# EAGLE design sheet1 (EAGLE 9.6.2)
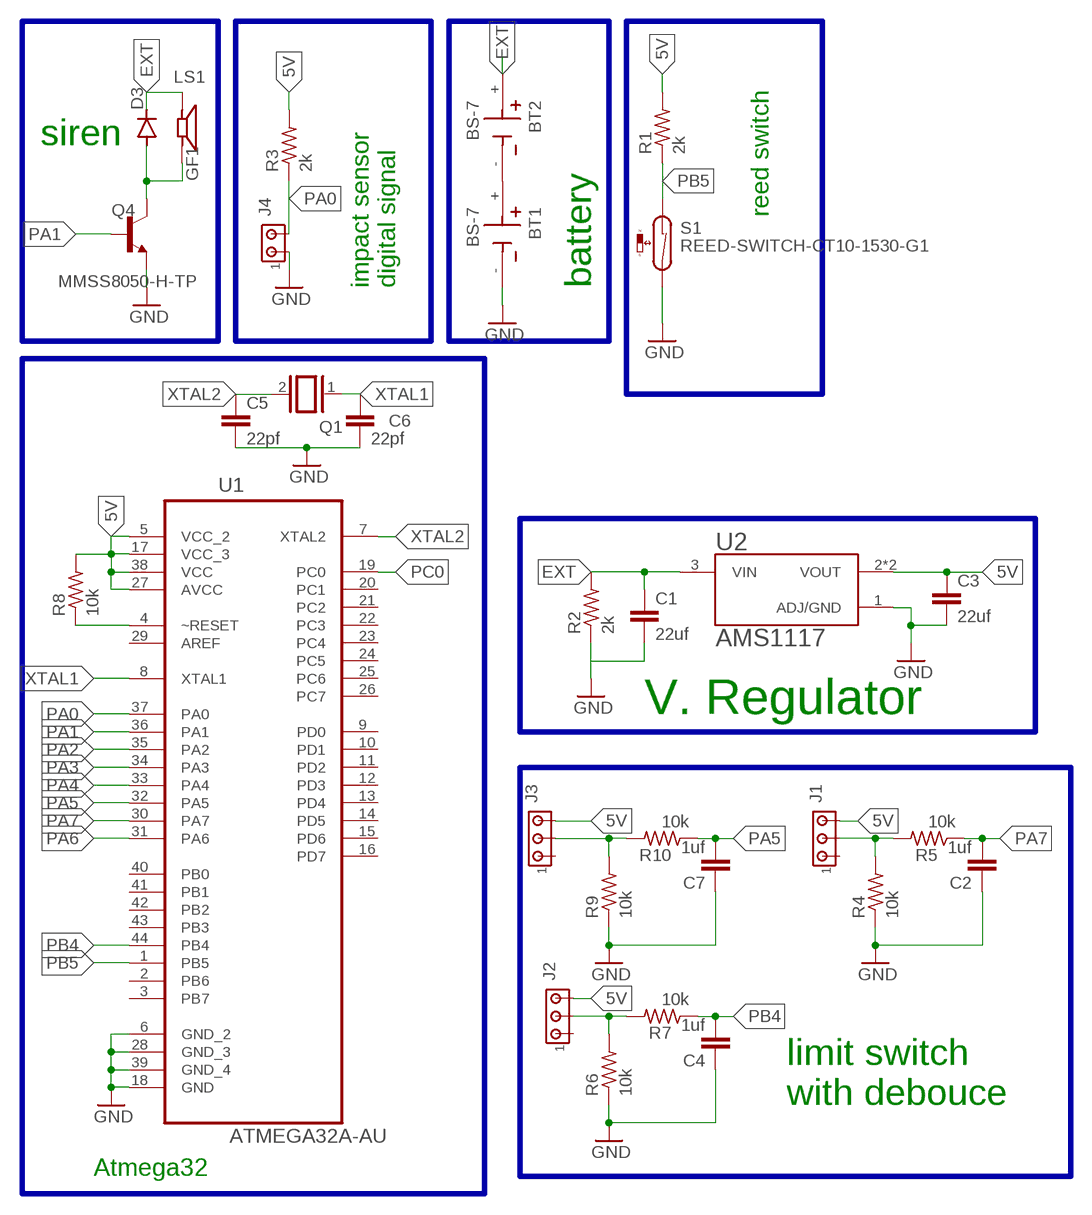
[diagram p0: schematic, sheet 1]

## Parts
BT1  BS-7  [BAT_BS-7]
BT2  BS-7  [BAT_BS-7]
C1  22uf  C-EUC1206  [C1206]
C2  1uf  C-EUC1206  [C1206]
C3  22uf  C-EUC1206  [C1206]
C4  1uf  C-EUC1206  [C1206]
C5  22pf  C-EUC1206  [C1206]
C6  22pf  C-EUC1206  [C1206]
C7  1uf  C-EUC1206  [C1206]
D3  GF1  [SMA-DO214AC]
J1  MTA03-100  [10X03MTA]
J2  MTA03-100  [10X03MTA]
J3  MTA03-100  [10X03MTA]
J4  MTA02-100  [10X02MTA]
LS1  CEP-1152  [CUI_CEP-1152]
Q1  XTAL/S  [QS]
Q4  MMSS8050-H-TP  [TRANS_MMSS8050-H-TP]
R1  2k  R-US_R1206  [R1206]
R2  2k  R-US_R1206  [R1206]
R3  2k  R-US_R1206  [R1206]
R4  10k  R-US_R1206  [R1206]
R5  10k  R-US_R1206  [R1206]
R6  10k  R-US_R1206  [R1206]
R7  10k  R-US_R1206  [R1206]
R8  10k  R-US_R1206  [R1206]
R9  10k  R-US_R1206  [R1206]
R10  10k  R-US_R1206  [R1206]
S1  REED-SWITCH-CT10-1530-G1  [CT10-G1]
U1  ATMEGA32A-AU  [QFP80P1200X1200X120-44N]
U2  AMS1117  [SOT229P700X180-4N]

## Nets
5V: C3.1 J1.3 J2.3 J3.3 R1.2 R3.2 R8.2 U1.5(VCC_2) U1.17(VCC_3) U1.27(AVCC) U1.38(VCC) U2.2(VOUT) U2.4(VOUT)
EXT: BT2.+ C1.1 D3.K(C) LS1.1 R2.2 U2.3(VIN)
GND: BT1.- C1.2 C2.1 C3.2 C4.1 C5.2 C6.2 C7.1 J4.1 Q4.2(E) R2.1 R4.1 R6.1 R9.1 S1.2 U1.6(GND_2) U1.18(GND) U1.28(GND_3) U1.39(GND_4) U2.1(ADJ/GND)
N$1: J1.2 R4.2 R5.2
N$3: BT1.+ BT2.-
N$4: R8.1 U1.4(~RESET)
N$6: J3.2 R9.2 R10.2
N$10: J2.2 R6.2 R7.2
N$27: D3.A LS1.2 Q4.3(C)
PA0: J4.2 R3.1 U1.37(PA0)
PA1: Q4.1(B) U1.36(PA1)
PA2: U1.35(PA2)
PA3: U1.34(PA3)
PA4: U1.33(PA4)
PA5: C7.2 R10.1 U1.32(PA5)
PA6: U1.31(PA6)
PA7: C2.2 R5.1 U1.30(PA7)
PB4: C4.2 R7.1 U1.44(PB4)
PB5: R1.1 S1.1 U1.1(PB5)
PC0: U1.19(PC0)
XTAL1: C6.1 Q1.1 U1.8(XTAL1)
XTAL2: C5.1 Q1.2 U1.7(XTAL2)
Unconnected: J1.1 J2.1 J3.1 U1.2(PB6) U1.3(PB7) U1.9(PD0) U1.10(PD1) U1.11(PD2) U1.12(PD3) U1.13(PD4) U1.14(PD5) U1.15(PD6) U1.16(PD7) U1.20(PC1) U1.21(PC2) U1.22(PC3) U1.23(PC4) U1.24(PC5) U1.25(PC6) U1.26(PC7) U1.29(AREF) U1.40(PB0) U1.41(PB1) U1.42(PB2) U1.43(PB3)

## Buses
B$1
B$2
5V,PA1,GND
B$3
B$4
B$5
B$6

## Notes on the sheet
- siren
- reed switch
- impact sensor 
  digital signal
- battery
- V. Regulator
- limit switch 
  with debouce
- Atmega32

## Library data of the parts
BT1 BT2 = BS-7:BS-7: BATTERY HOLDER COIN 20MM PC PIN; AVAILABILITY: Unavailable; DESCRIPTION: BATTERY HOLDER COIN 20MM PC PIN; MF: MPD _Memory; MP: BS-7; PACKAGE: None; PRICE: None
C1-C7 = rcl:C-EU: CAPACITOR, European symbol; SPICEPREFIX: C
D3 = diode:GF1: DIODE
J1-J3 = con-amp:MTA03-100: AMP connector
J4 = con-amp:MTA02-100: AMP connector
LS1 = CEP-1152:CEP-1152: 16.5 mm, 30 V, 84 dB, Through Hole, Piezo Audio Transducer Buzzer; AVAILABILITY: Unavailable; CUI_PURCHASE_URL: https://www.cuidevices.com/product/audio/buzzers/audio-transducers/cep-1152?utm_source=snapeda.com&utm_medium=referral&utm_campaign=snapedaBOM; DESCRIPTION: 16.5 mm, 30 V, 84 dB, Through Hole, Piezo Audio Transducer Buzzer; DIGIKEY-PURCHASE-URL: https://snapeda.com/shop?store=DigiKey&id=2769834; MF: CUI Devices; MP: CEP-1152; PACKAGE: CUI; PRICE: None
Q1 = special:XTAL/S: CRYSTAL
Q4 = MMSS8050-H-TP:MMSS8050-H-TP: MMSS8050-H Series 25 V 1.5 A NPN Silicon Plastic-Encapsulate Transistor-SOT-23; AVAILABILITY: Unavailable; DESCRIPTION: Bipolar _BJT_ Transistor NPN 25V 1.5A 100MHz 625mW Surface Mount SOT-23; MF: Micro Commercial; MP: MMSS8050-H-TP; PACKAGE: SOT-23 Micro Commercial; PRICE: None
R1-R10 = rcl:R-US_: RESISTOR, American symbol; SPICEPREFIX: R
S1 = switch-reed:REED-SWITCH-: Reed Sensor; MF: COTO TECHNOLOGY; MPN: CT10-1530-G1; OC_FARNELL: 1081696
U1 = ATMEGA32A-AU:ATMEGA32A-AU: 8-bit Microcontroller; AVAILABILITY: Unavailable; DESCRIPTION: AVR AVR® ATmega Microcontroller IC 8-Bit 16MHz 32KB (16K x 16) FLASH 44-TQFP (10x10); MF: Microchip; MP: ATMEGA32A-AU; PACKAGE: TQFP-44 Microchip; PRICE: None
U2 = AMS1117:AMS1117: Sot223/Pkg 1-Amp 5-Volt Low Drop Out Voltage Regulatator; AVAILABILITY: Unavailable; DESCRIPTION: UNO PLUS Arduino R3 Shield, Xbee Arduino IDE Wheeled Robotics Kit; MF: Seeed Technology; MP: AMS1117; PACKAGE: SOT-223 Seeed Technology; PRICE: None

## Board
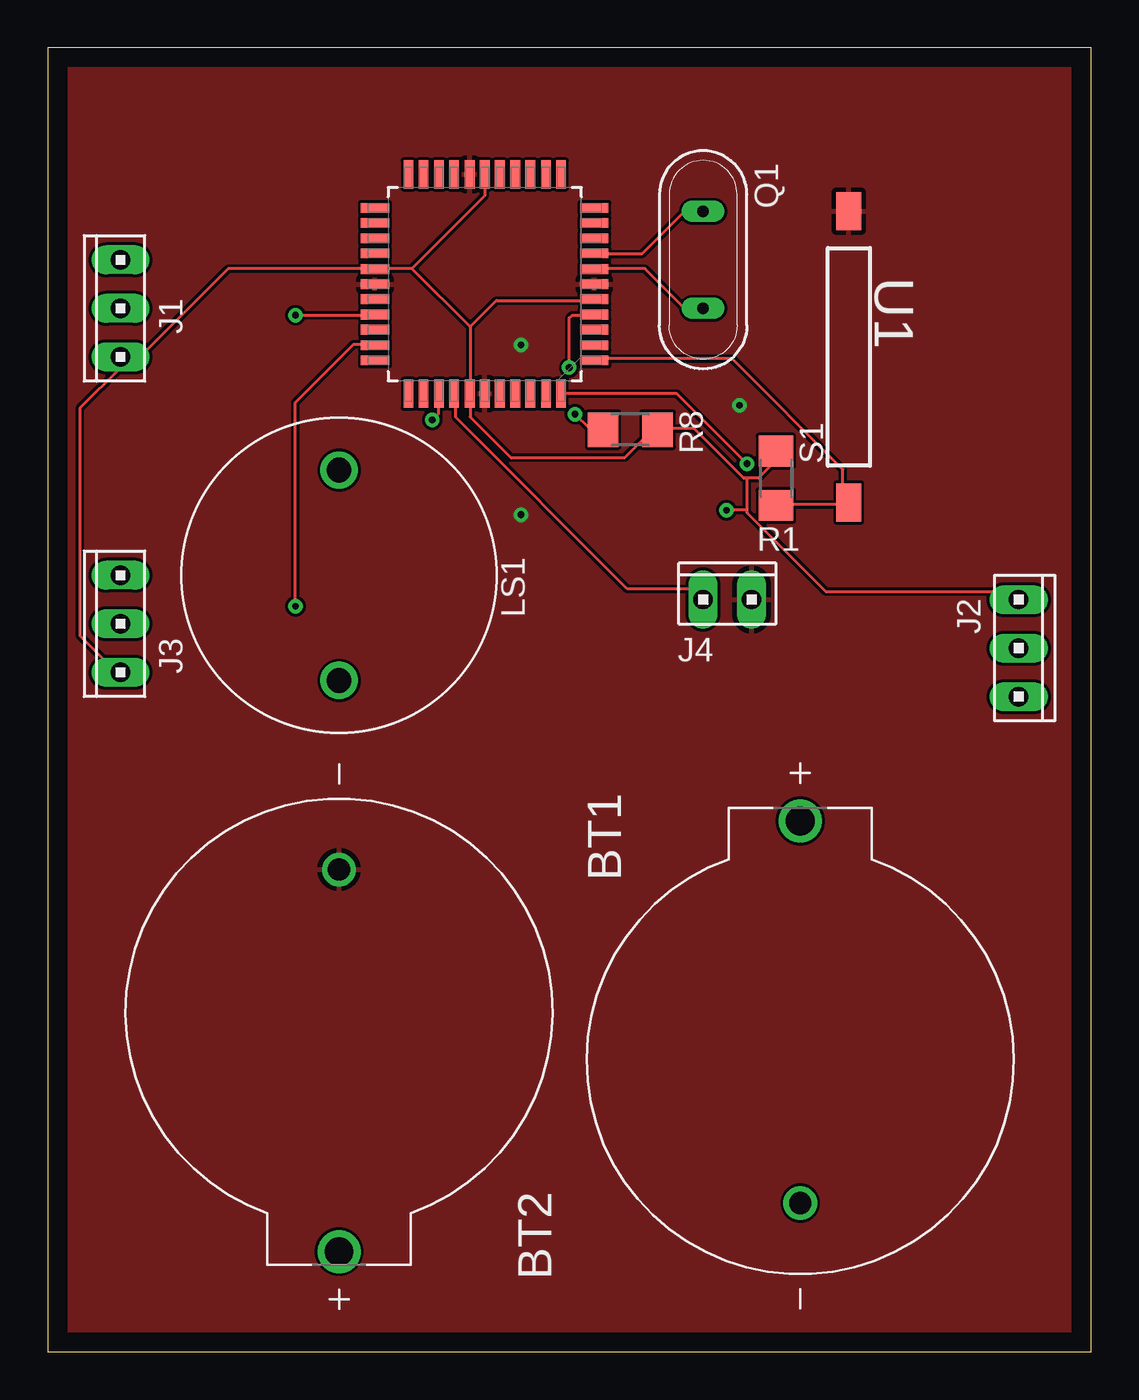
[diagram p1: board, top side]
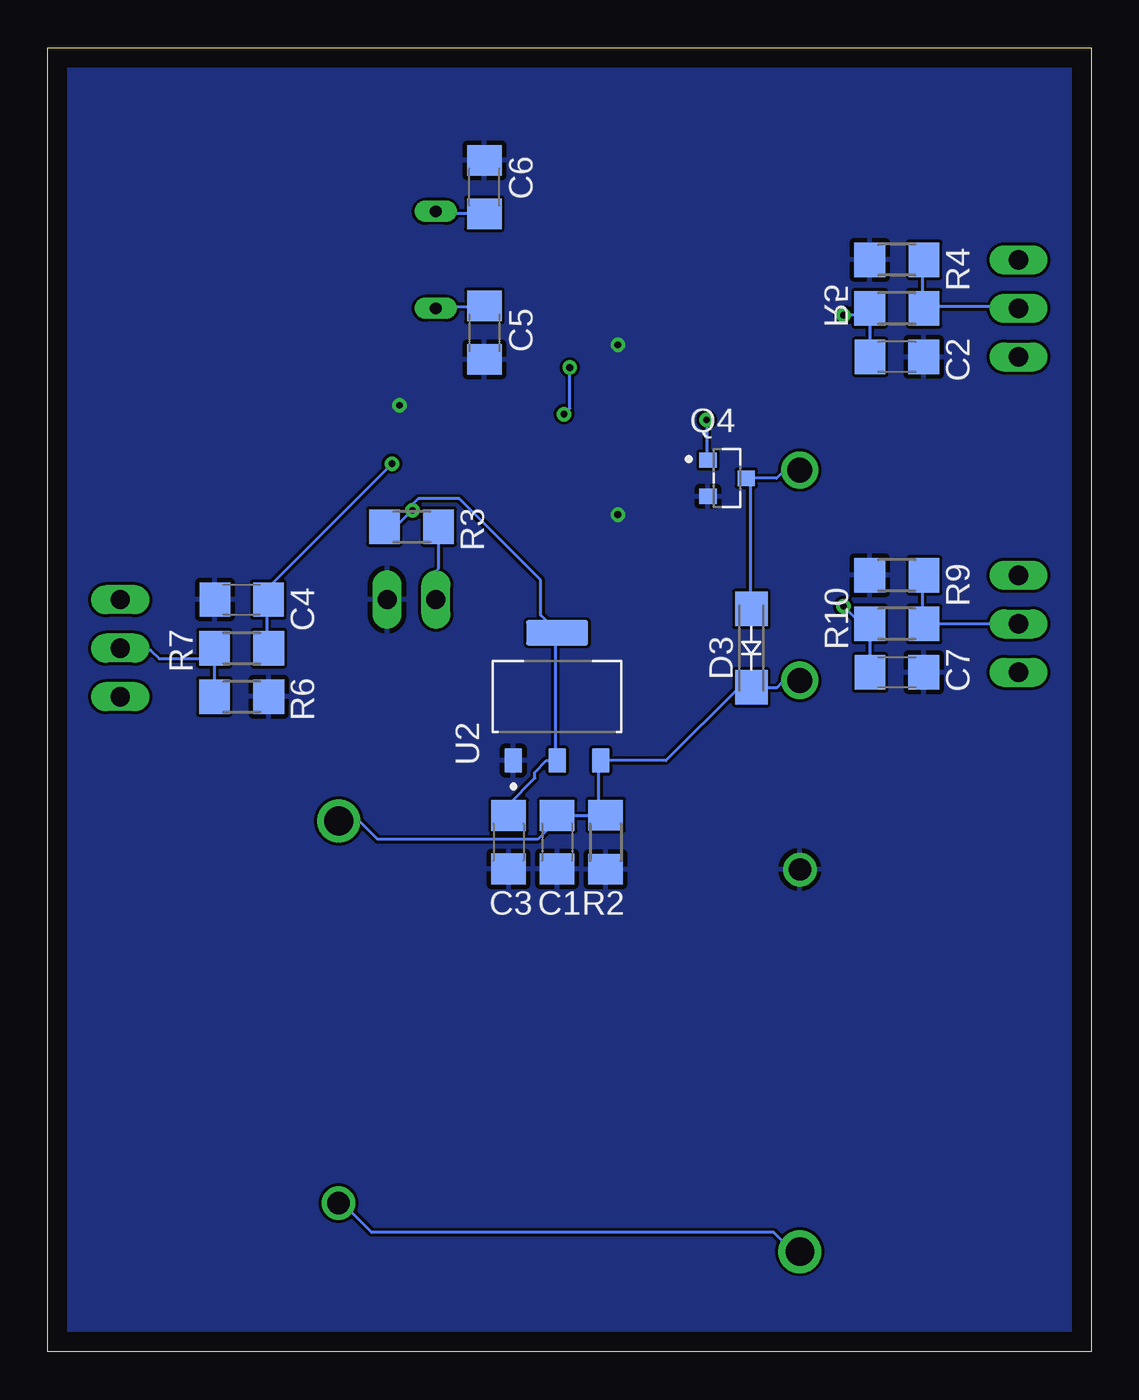
[diagram p2: board, bottom side, seen from below]

Size 54.59 x 68.25 mm. Coordinates in mm from the lower left corner, seen from the top.
Outline: 0,0 54.59,0 54.59,68.25 0,68.25 0,0
Copper layers (1*16): Top 0.035mm / dielectric 1.5mm / Bottom 0.035mm
Design rules "default": minimum track width 6mil, minimum drill 0.35mm, track to track 6mil, track to pad 6mil, pad to pad 6mil, via to via 6mil, smd to smd 6mil, copper to edge 40mil, drill to drill 6mil, minimum pad ring 10mil, minimum via ring 8mil, stop-mask expansion 4mil, vias tented up to drill 0mil, thermal gap 10mil

### Footprints (pad centres in the part's own frame; a part is rotated, then mirrored left to right if it is on the bottom)
BAT_BS-7 = drill 1.5: + 10,0 | drill 1.17: - -10,0
C1206 = smd 1.6 x 1.8: 1 -1.4,0; 2 1.4,0
SMA-DO214AC = smd 1.8 x 1.7: A -2.05,0; K 2.05,0
10X03MTA = drill 1.016 long: 1 2.54,0; 2 0,0; 3 -2.54,0
10X02MTA = drill 1.016 long: 1 1.27,0; 2 -1.27,0
CUI_CEP-1152 = drill 1.3: 1 -5.5,0; 2 5.5,0
QS = drill 0.61 long: 1 -2.54,0; 2 2.54,0
TRANS_MMSS8050-H-TP = smd 0.9 x 0.8: 1 -1,0.95; 2 -1,-0.95; 3 1,0
R1206 = smd 1.6 x 1.803: 1 -1.422,0; 2 1.422,0
CT10-G1 = smd 2 x 1.3: 1 -7.62,0; 2 7.62,0
QFP80P1200X1200X120-44N = smd 1.473 x 0.508: 1 -5.74,3.988; 2 -5.74,3.2; 3 -5.74,2.388; 4 -5.74,1.6; 5 -5.74,0.787; 6 -5.74,0; 7 -5.74,-0.787; 8 -5.74,-1.6; 9 -5.74,-2.388; 10 -5.74,-3.2; 11 -5.74,-3.988; 23 5.74,-3.988; 24 5.74,-3.2; 25 5.74,-2.388; 26 5.74,-1.6; 27 5.74,-0.787; 28 5.74,0; 29 5.74,0.787; 30 5.74,1.6; 31 5.74,2.388; 32 5.74,3.2; 33 5.74,3.988 | smd 0.508 x 1.473: 12 -3.988,-5.74; 13 -3.2,-5.74; 14 -2.388,-5.74; 15 -1.6,-5.74; 16 -0.787,-5.74; 17 0,-5.74; 18 0.787,-5.74; 19 1.6,-5.74; 20 2.388,-5.74; 21 3.2,-5.74; 22 3.988,-5.74; 34 3.988,5.74; 35 3.2,5.74; 36 2.388,5.74; 37 1.6,5.74; 38 0.787,5.74; 39 0,5.74; 40 -0.787,5.74; 41 -1.6,5.74; 42 -2.388,5.74; 43 -3.2,5.74; 44 -3.988,5.74
SOT229P700X180-4N = smd 1.31 x 0.93: 1 -3.345,2.29; 2 -3.345,0; 3 -3.345,-2.29 | smd 1.31 x 3.24: 4 3.345,0

### Placement (x,y rotation side)
BT1  15.24,15.24 270 top
BT2  39.37,17.78 90 top
C1  27.94,26.67 270 bottom
C2  10.16,52.07 180 bottom
C3  30.48,26.67 270 bottom
C4  44.45,39.37 0 bottom
C5  31.75,53.34 270 bottom
C6  31.75,60.96 90 bottom
C7  10.16,35.56 180 bottom
D3  17.78,36.83 270 bottom
J1  3.81,54.61 90 top
J2  50.8,36.83 270 top
J3  3.81,38.1 90 top
J4  35.56,39.37 0 top
LS1  15.24,40.64 90 top
Q1  34.29,57.15 270 top
Q4  19.05,45.72 0 bottom
R1  38.1,45.72 90 top
R2  25.4,26.67 90 bottom
R3  35.56,43.18 180 bottom
R4  10.16,57.15 0 bottom
R5  10.16,54.61 0 bottom
R6  44.45,34.29 180 bottom
R7  44.45,36.83 180 bottom
R8  30.48,48.26 0 top
R9  10.16,40.64 0 bottom
R10  10.16,38.1 0 bottom
S1  41.91,52.07 90 top
U1  22.86,55.88 180 top
U2  27.94,34.29 90 bottom

### Tracks (layer width: path | path; a pad name or v marks a point on that pad's centre or on a via)
5V  (via drill 0.35)
  Top 0.152: 36.58,45.72 37.19,45.72 38.1,46.63 R1.2 | 36.58,45.72 36.42,45.72 33.83,48.31 32,48.31 R8.2 31.85,48.16 31.55,48.16 30.18,46.79 24.23,46.79 22.1,48.92 22.1,50.14 | 36.58,45.72 36.58,44.04 | 36.58,44.04 36.58,43.92 40.72,39.78 50.6,39.78 J2.3 | 36.58,44.04 v35.51,44.04 | J3.3 3.61,35.56 1.68,37.49 1.68,49.38 3.81,51.51 J1.3 3.81,52.12 4.88,52.12 9.45,56.69 17.07,56.69 U1.27 17.22,56.69 19.05,56.69 | 19.05,56.69 22.86,60.5 U1.17 | 22.1,53.65 22.1,50.14 | 19.05,56.69 22.1,53.65 | 22.1,53.65 23.47,55.02 28.5,55.02 U1.5 | 22.1,50.14 U1.38
  Bottom 0.152: C3.1 30.48,28.65 29.11,30.02 29.11,30.33 28.5,30.94 28.04,30.94 U2.2 28.04,31.09 28.04,37.49 U2.4 27.89,37.64 28.8,38.56 28.8,40.39 33.07,44.65 35.2,44.65 35.51,44.35 v35.51,44.04 36.27,43.28 36.88,43.28 R3.2
EXT
  Bottom 0.152: 27.74,28.04 25.45,28.04 R2.2 25.45,28.19 25.76,28.5 25.76,30.94 U2.3 25.6,30.94 22.25,30.94 18.44,34.75 17.83,34.75 D3.K 17.68,34.75 16.46,34.75 16.15,35.05 15.24,35.05 LS1.1 | 27.74,28.04 27.89,28.04 C1.1 27.74,28.04 | 27.74,28.04 28.96,26.82 37.34,26.82 38.25,27.74 39.32,27.74 BT2.+
GND  (via drill 0.35)
  other vias: 24.77,52.7 24.77,43.81 36.2,49.53
  pour Top: 0,68.58 54.61,68.58 54.61,0 43.18,0 0,0
  pour Bottom: 0,68.58 54.61,68.58 54.61,0 0,0
N$1
  Bottom 0.152: 8.84,55.17 8.84,57.15 R4.2 | 8.84,55.17 8.84,54.71 | 8.84,54.71 R5.2 8.84,55.17 | 8.84,54.71 3.81,54.71 J1.2
N$3
  Bottom 0.152: BT2.- 39.32,7.77 38.86,7.32 38.71,7.32 37.64,6.25 16.61,6.25 15.7,5.33 15.24,5.33 BT1.+
N$4  (via drill 0.35)
  Top 0.152: v27.28,51.51 27.28,54.1 27.43,54.25 28.5,54.25 U1.4 | v27.58,49.07 28.35,48.31 28.96,48.31 R8.1
  Bottom 0.152: v27.28,51.51 27.28,49.38 v27.58,49.07
N$6
  Bottom 0.152: R9.2 8.84,40.54 8.84,38.71 8.84,38.1 R10.2 J3.2
N$10
  Bottom 0.152: 45.87,36.27 45.87,36.73 R7.2 45.87,36.27 | 45.87,36.27 R6.2 | R6.2 | 45.87,36.27 48.77,36.27 49.23,36.73 50.75,36.73 J2.2
N$27
  Bottom 0.152: 17.83,45.72 16.46,45.72 16.15,46.02 15.24,46.02 LS1.2 | 17.83,45.72 Q4.3 | 17.83,45.72 17.83,39.01 D3.A
PA0
  Top 0.152: U1.37 21.34,50.14 21.34,48.92 30.33,39.93 33.83,39.93 34.29,39.47 J4.2
  Bottom 0.152: J4.2 34.29,40.84 34.14,41 34.14,43.13 R3.1
PA1  (via drill 0.35)
  Top 0.152: v20.12,48.77 20.42,49.07 20.42,50.14 U1.36
  Bottom 0.152: v20.12,48.77 20.12,46.79 Q4.1
PA5  (via drill 0.35)
  Top 0.152: v12.95,39.01 12.95,49.68 16,52.73 17.07,52.73 U1.32
  Bottom 0.152: v12.95,39.01 12.04,38.1 R10.1 | R10.1 11.58,35.66 C7.2 | R10.1
PA7  (via drill 0.35)
  Top 0.152: v12.95,54.25 17.07,54.25 U1.30
  Bottom 0.152: 11.89,54.25 v12.95,54.25 | 11.89,54.25 11.58,54.56 R5.1 11.89,54.25 | 11.89,54.25 11.58,53.95 11.58,52.12 C2.2
PB4  (via drill 0.35)
  Top 0.152: U1.44 32.92,50.14 v36.58,46.48
  Bottom 0.152: v36.58,46.48 42.98,40.08 42.98,39.47 C4.2 43.13,39.32 43.13,36.88 R7.1
PB5
  Top 0.152: U1.1 28.65,51.97 35.81,51.97 41.6,46.18 41.6,44.81 41.91,44.5 S1.1 41.91,44.35 38.1,44.35 R1.1
XTAL1
  Top 0.152: U1.8 28.65,57.45 31.09,57.45 33.22,59.59 34.29,59.59 Q1.1
  Bottom 0.152: C6.1 31.85,59.59 34.29,59.59 Q1.1
XTAL2
  Top 0.152: U1.7 28.65,56.69 31.24,56.69 33.22,54.71 34.29,54.71 Q1.2
  Bottom 0.152: C5.1 31.85,54.71 34.29,54.71 Q1.2

### Text on the board
bNames: R5